# Altium project AMC_FMC_Carrier v4.PrjPcb (part 17 of 17)
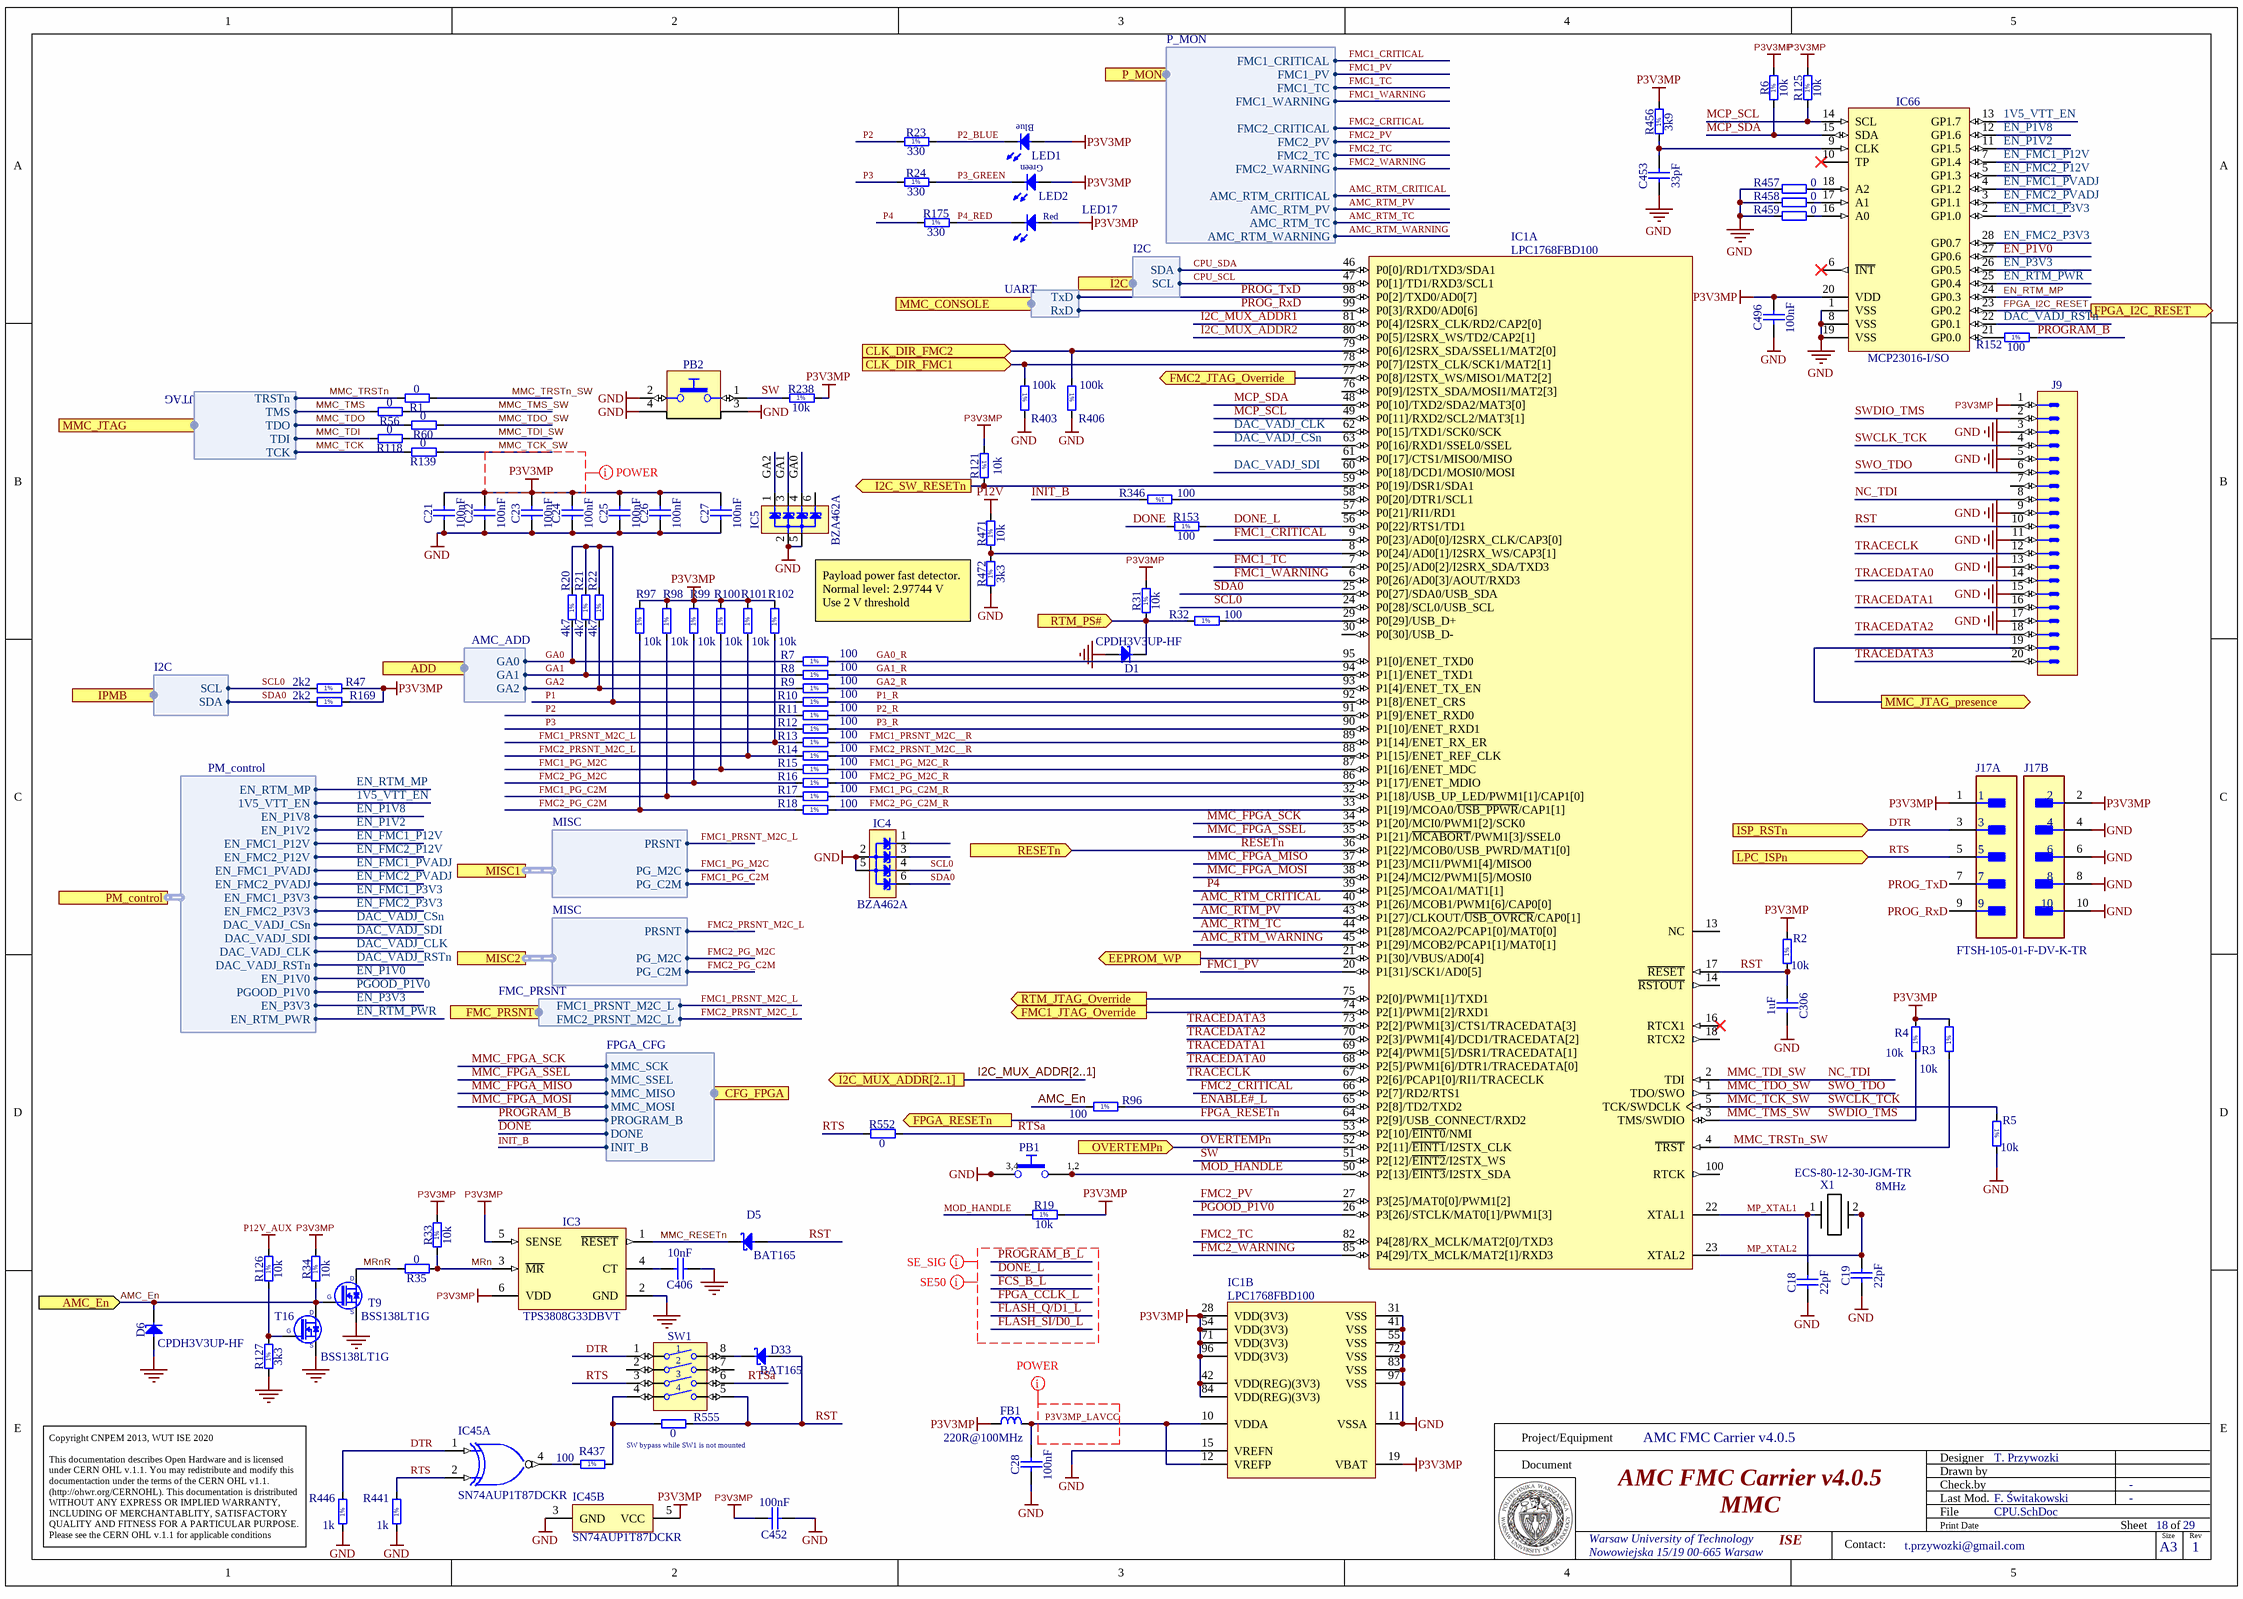
[diagram p33: CPU.SchDoc]

## Assembly variants
FMC: not fitted B5 B6 B7 B8 C219 C220 C221 C222 C223 C224 C225 C227 C228 C397 C399 C422 C425 C455 C461 C463 C512 C514 C575 C590 C625 C751 C752 C753 C777 C778 C779 C780 C781 C782 C783 C784 C785 C786 C787 C788 C789 C790 C791 C792 C793 C794 C795 C796 C797 C798 C799 C800 C801 C802 C803 C804 C805 C806 C807 C808 C809 C810 C811 C812 C822 C823 C824 C825 C826 C827 C828 C829 C830 C831 C832 C833 C834 C835 C836 C837 C838 C839 C845 C883 C884 C885 C886 C887 D33 R27 R28 R29 R51 R128 R154 R155 R156 R208 R210 R212 R215 R216 R218 R224 R229 R245 R249 R250 R252 R292 R295 R296 R352 R353 R354 R355 R356 R357 R358 R360 R362 R364 R366 R368 R370 R372 R374 R376 R378 R384 R386 R390 R436 R438 R441 R442 R446 R448 R449 R450 R460 R461 R474 R476 R478 R479 R480 R482 R483 R484 R486 R488 R490 R492 R494 R496 R498 R500 R502 R504 R506 R508 R510 R512 R514 R516 R518 R520 R522 R524 R526 R528 R530 R532 R534 R535 R536 R538 R539 R543 R544 R546 R548 R549 R551 R563 SW1; alternate parts OSC1 -> OSC_0.2-800MHZ_SILICON-LAB_549BACB001937ABG
RTM: not fitted B5 B6 B7 B8 C178 C179 C180 C181 C182 C183 C184 C185 C186 C187 C188 C189 C190 C191 C192 C193 C194 C195 C196 C197 C198 C199 C200 C201 C202 C203 C204 C205 C206 C207 C216 C217 C318 C319 C320 C321 C322 C323 C324 C325 C326 C327 C328 C329 C330 C331 C332 C333 C397 C399 C405 C407 C626 C627 C628 C629 C630 C631 C632 C633 C822 C823 C824 C825 C826 C827 C828 C829 C830 C831 C832 C833 C834 C835 C836 C837 C840 C841 C883 C884 C885 C886 R28 R128 R154 R155 R208 R210 R212 R224 R229 R243 R251 R299 R359 R363 R375 R383 R384 R385 R436 R441 R443 R445 R446 R460 R461 R475 R479 R483 R525 R527 R529 R531 R533 R537 R543 R545 R547 R551 R564; alternate parts OSC2 -> OSC_10-160MHZ_SILICON-LAB_Si570CAC000121DG
LNLS_FOFB: not fitted B5 B6 B7 B8 C198 C199 C200 C201 C202 C203 C204 C205 C206 C207 C221 C222 C223 C224 C225 C227 C228 C422 C425 C455 C512 C514 C575 C590 C625 C626 C627 C628 C629 C630 C631 C632 C633 C751 C752 C753 C777 C778 C779 C780 C781 C782 C783 C784 C785 C786 C787 C788 C789 C790 C791 C792 C793 C794 C795 C796 C797 C798 C799 C800 C801 C802 C803 C804 C805 C806 C807 C808 C809 C810 C811 C812 C838 C839 C840 C841 C845 C883 C884 C885 C886 C887 D33 R27 R28 R29 R128 R156 R208 R210 R212 R218 R224 R229 R243 R251 R292 R295 R296 R352 R353 R354 R355 R356 R357 R359 R363 R375 R383 R384 R385 R436 R441 R445 R446 R449 R475 R479 R483 R525 R527 R529 R531 R533 R537 R543 R545 R547 R551 R564 SW1; alternate parts OSC2 -> OSC_10-160MHZ_SILICON-LAB_Si570CAC000121DG
RTM_Default: not fitted B5 B6 B7 B8 C178 C179 C180 C181 C182 C183 C184 C185 C186 C187 C188 C189 C190 C191 C192 C193 C194 C195 C196 C197 C198 C199 C200 C201 C202 C203 C204 C205 C206 C207 C216 C217 C318 C319 C320 C321 C322 C323 C324 C325 C326 C327 C328 C329 C330 C331 C332 C333 C397 C399 C405 C407 C422 C425 C626 C627 C628 C629 C630 C631 C632 C633 C822 C823 C824 C825 C826 C827 C828 C829 C830 C831 C832 C833 C834 C835 C836 C837 C840 C841 C845 C883 C884 C885 C886 C887 D33 R28 R128 R154 R155 R208 R210 R212 R218 R224 R229 R243 R251 R299 R352 R353 R359 R363 R375 R383 R384 R385 R436 R441 R443 R445 R446 R449 R460 R461 R475 R479 R483 R525 R527 R529 R531 R533 R537 R543 R545 R547 R551 R564 SW1; alternate parts OSC1 -> OSC_10-280MHZ_SILICON-LAB_Si570BBC000121DG, OSC2 -> OSC_10-160MHZ_SILICON-LAB_Si570CAC000121DG
GSI: not fitted B5 B6 B7 B8 C219 C220 C221 C222 C223 C224 C225 C227 C228 C397 C399 C422 C425 C455 C512 C514 C575 C590 C625 C751 C752 C753 C777 C778 C779 C780 C781 C782 C783 C784 C785 C786 C787 C788 C789 C790 C791 C792 C793 C794 C795 C796 C797 C798 C799 C800 C801 C802 C803 C804 C805 C806 C807 C808 C809 C810 C811 C812 C822 C823 C824 C825 C826 C827 C828 C829 C830 C831 C832 C833 C834 C835 C836 C837 C838 C839 C845 C883 C884 C885 C886 C887 D33 R27 R28 R29 R51 R128 R156 R208 R210 R212 R215 R216 R218 R224 R229 R245 R249 R250 R252 R292 R295 R296 R352 R353 R354 R355 R356 R357 R358 R360 R362 R364 R366 R368 R370 R372 R374 R376 R378 R383 R384 R386 R390 R436 R438 R441 R442 R446 R448 R449 R450 R476 R478 R480 R482 R484 R486 R488 R490 R492 R494 R496 R498 R500 R502 R504 R506 R508 R510 R512 R514 R516 R518 R520 R522 R524 R526 R528 R530 R532 R534 R535 R536 R538 R539 R543 R544 R546 R548 R549 R551 R564 SW1; alternate parts OSC2 -> OSC_10-160MHZ_SILICON-LAB_Si570CAC000121DG
DUNE: not fitted B5 B6 B7 B8 C218 C219 C220 C318 C319 C320 C321 C322 C323 C324 C325 C326 C327 C328 C329 C330 C331 C332 C333 C396 C397 C399 C422 C425 C461 C463 C777 C778 C779 C780 C781 C782 C783 C784 C785 C786 C787 C788 C789 C790 C791 C792 C793 C794 C795 C796 C797 C798 C799 C800 C801 C802 C803 C804 C805 C806 C807 C808 C809 C810 C811 C812 C822 C823 C824 C825 C826 C827 C828 C829 C830 C831 C832 C833 C834 C835 C836 C837 C838 C839 C845 C883 C884 C885 C886 C887 D33 PB2 R27 R28 R29 R51 R128 R154 R155 R156 R208 R210 R212 R215 R216 R218 R224 R229 R245 R249 R250 R252 R292 R295 R296 R352 R353 R354 R355 R356 R357 R358 R360 R362 R364 R366 R368 R370 R372 R374 R376 R378 R383 R384 R386 R390 R436 R438 R441 R442 R446 R448 R449 R450 R460 R461 R476 R478 R479 R480 R482 R483 R484 R486 R488 R490 R492 R494 R496 R498 R500 R502 R504 R506 R508 R510 R512 R514 R516 R518 R520 R522 R524 R526 R528 R530 R532 R534 R535 R536 R538 R539 R543 R544 R545 R546 R547 R548 R549 R551 R564 SW1; alternate parts OSC1 -> OSC_10-280MHZ_SILICON-LAB_Si570BBC000121DG, OSC2 -> OSC_10-160MHZ_SILICON-LAB_Si570CAC000121DG